# EAGLE design x-OSC Gloves_v2 (EAGLE 6.4)
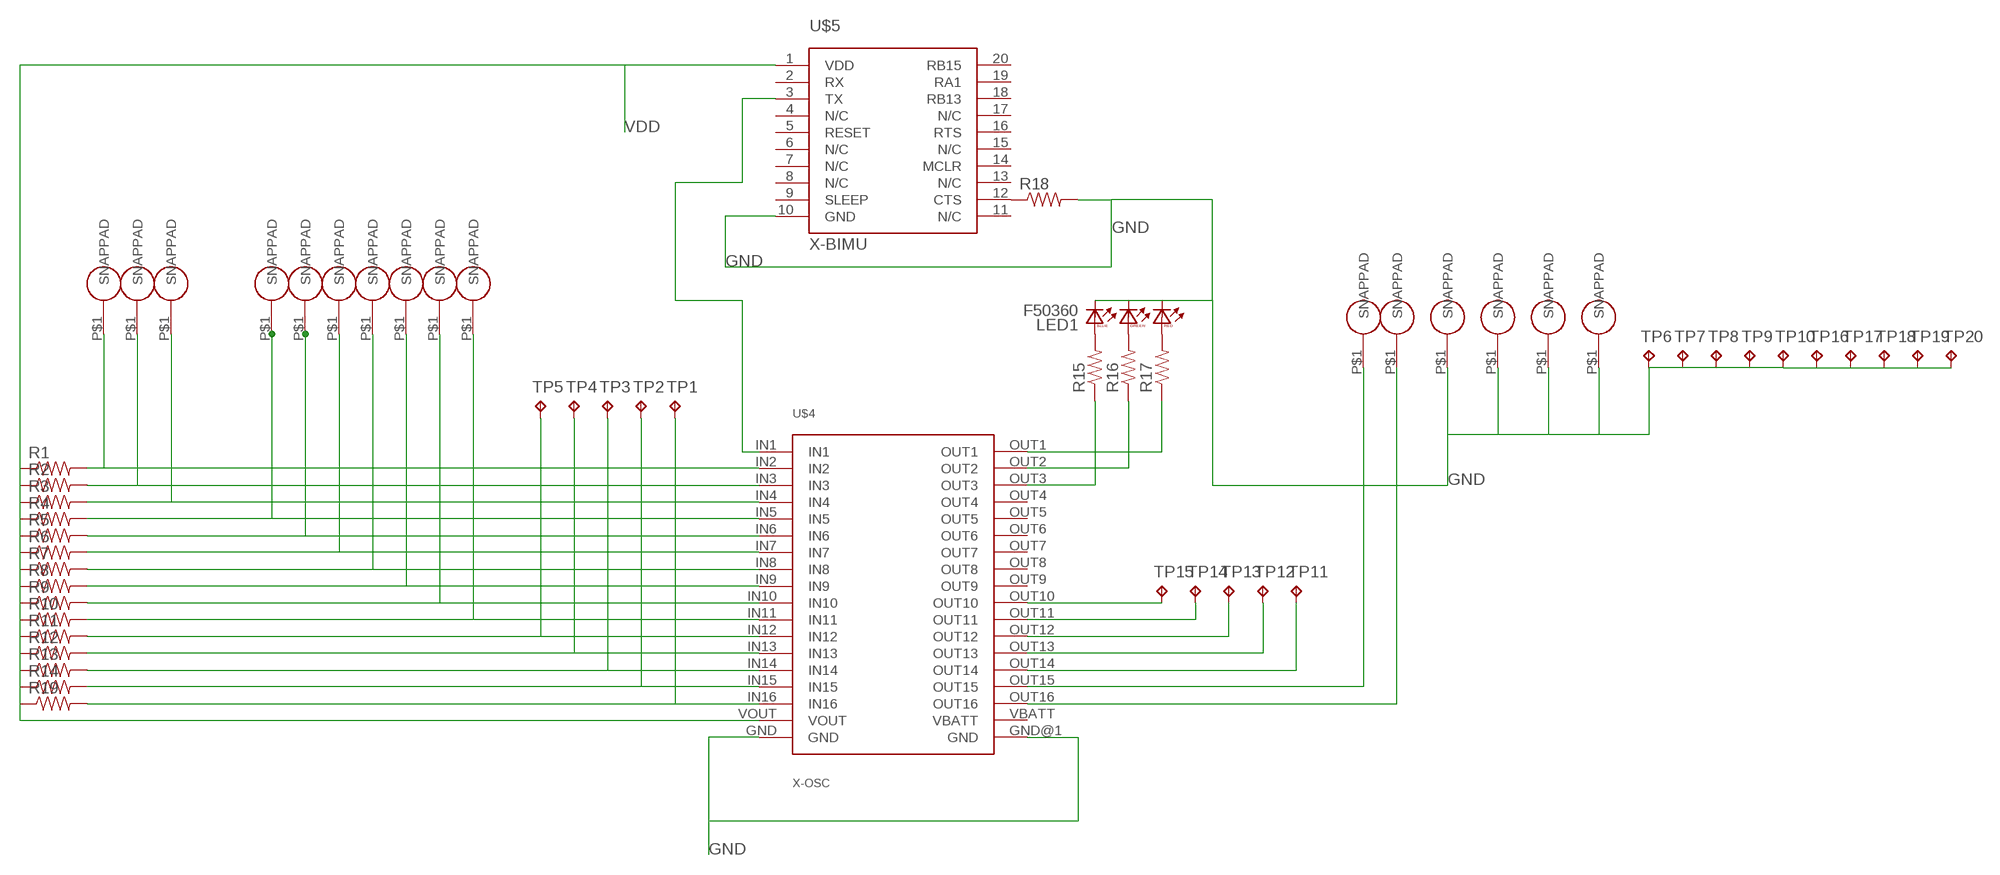
[diagram p0: schematic, sheet 1]

## Parts
LED1  F50360  [F50360]
R1  RESISTOR0805-RES  [0805]
R2  RESISTOR0805-RES  [0805]
R3  RESISTOR0805-RES  [0805]
R4  RESISTOR0805-RES  [0805]
R5  RESISTOR0805-RES  [0805]
R6  RESISTOR0805-RES  [0805]
R7  RESISTOR0805-RES  [0805]
R8  RESISTOR0805-RES  [0805]
R9  RESISTOR0805-RES  [0805]
R10  RESISTOR0805-RES  [0805]
R11  RESISTOR0805-RES  [0805]
R12  RESISTOR0805-RES  [0805]
R13  RESISTOR0805-RES  [0805]
R14  RESISTOR0805-RES  [0805]
R15  RESISTOR0805-RES  [0805]
R16  RESISTOR0805-RES  [0805]
R17  RESISTOR0805-RES  [0805]
R18  RESISTOR0805-RES  [0805]
R19  RESISTOR0805-RES  [0805]
TP1  TPTP20R  [TP20R]
TP2  TPTP20R  [TP20R]
TP3  TPTP20R  [TP20R]
TP4  TPTP20R  [TP20R]
TP5  TPTP20R  [TP20R]
TP6  TPTP20R  [TP20R]
TP7  TPTP20R  [TP20R]
TP8  TPTP20R  [TP20R]
TP9  TPTP20R  [TP20R]
TP10  TPTP20R  [TP20R]
TP11  TPTP20R  [TP20R]
TP12  TPTP20R  [TP20R]
TP13  TPTP20R  [TP20R]
TP14  TPTP20R  [TP20R]
TP15  TPTP20R  [TP20R]
TP16  TPTP20R  [TP20R]
TP17  TPTP20R  [TP20R]
TP18  TPTP20R  [TP20R]
TP19  TPTP20R  [TP20R]
TP20  TPTP20R  [TP20R]
U$1  SNAP-PAD_7MM_ROUND  [SNAP-PAD_7MM_RD]
U$2  SNAP-PAD_7MM_ROUND  [SNAP-PAD_7MM_RD]
U$3  SNAP-PAD_7MM_ROUND  [SNAP-PAD_7MM_RD]
U$4  X-OSC  [X-OSC_SMD]
U$5  X-BIMU  [X-BIMU_SMD]
U$6  SNAP-PAD_7MM_ROUND  [SNAP-PAD_7MM_RD]
U$7  SNAP-PAD_7MM_ROUND  [SNAP-PAD_7MM_RD]
U$8  SNAP-PAD_7MM_ROUND  [SNAP-PAD_7MM_RD]
U$9  SNAP-PAD_7MM_ROUND  [SNAP-PAD_7MM_RD]
U$10  SNAP-PAD_7MM_ROUND  [SNAP-PAD_7MM_RD]
U$11  SNAP-PAD_7MM_ROUND  [SNAP-PAD_7MM_RD]
U$12  SNAP-PAD_7MM_ROUND  [SNAP-PAD_7MM_RD]
U$13  SNAP-PAD_7MM_ROUND  [SNAP-PAD_7MM_RD]
U$14  SNAP-PAD_7MM_ROUND  [SNAP-PAD_7MM_RD]
U$15  SNAP-PAD_7MM_ROUND  [SNAP-PAD_7MM_RD]
U$16  SNAP-PAD_7MM_ROUND  [SNAP-PAD_7MM_RD]
U$17  SNAP-PAD_7MM_ROUND  [SNAP-PAD_7MM_RD]
U$18  SNAP-PAD_7MM_ROUND  [SNAP-PAD_7MM_RD]

## Nets
GND: LED1.BC LED1.GC LED1.RC R18.2 TP6.TP TP7.TP TP8.TP TP9.TP TP10.TP TP16.TP TP17.TP TP18.TP TP19.TP TP20.TP U$4.GND U$4.GND@1(GND) U$5.10(GND) U$15.P$1(SNAPPAD) U$16.P$1(SNAPPAD) U$17.P$1(SNAPPAD) U$18.P$1(SNAPPAD)
N$1: LED1.BA R15.2
N$2: LED1.GA R16.2
N$3: R15.1 U$4.OUT3
N$4: R1.2 U$1.P$1(SNAPPAD) U$4.IN2
N$5: R16.1 U$4.OUT2
N$6: R2.2 U$2.P$1(SNAPPAD) U$4.IN3
N$7: R3.2 U$3.P$1(SNAPPAD) U$4.IN4
N$8: R4.2 U$4.IN5 U$6.P$1(SNAPPAD)
N$9: R5.2 U$4.IN6 U$7.P$1(SNAPPAD)
N$10: R18.1 U$5.12(CTS)
N$11: U$4.IN1 U$5.3(TX)
N$12: R6.2 U$4.IN7 U$8.P$1(SNAPPAD)
N$13: R7.2 U$4.IN8 U$9.P$1(SNAPPAD)
N$14: R8.2 U$4.IN9 U$10.P$1(SNAPPAD)
N$15: R9.2 U$4.IN10 U$11.P$1(SNAPPAD)
N$16: R10.2 U$4.IN11 U$12.P$1(SNAPPAD)
N$17: LED1.RA R17.2
N$18: R11.2 TP5.TP U$4.IN12
N$19: R12.2 TP4.TP U$4.IN13
N$20: R13.2 TP3.TP U$4.IN14
N$21: R14.2 TP2.TP U$4.IN15
N$22: R19.2 TP1.TP U$4.IN16
N$23: U$4.OUT15 U$13.P$1(SNAPPAD)
N$24: U$4.OUT16 U$14.P$1(SNAPPAD)
N$25: R17.1 U$4.OUT1
N$26: TP11.TP U$4.OUT14
N$29: TP12.TP U$4.OUT13
N$30: TP13.TP U$4.OUT12
N$31: TP14.TP U$4.OUT11
N$32: TP15.TP U$4.OUT10
VDD: R1.1 R2.1 R3.1 R4.1 R5.1 R6.1 R7.1 R8.1 R9.1 R10.1 R11.1 R12.1 R13.1 R14.1 R19.1 U$4.VOUT U$5.1(VDD)
Unconnected: U$4.OUT4 U$4.OUT5 U$4.OUT6 U$4.OUT7 U$4.OUT8 U$4.OUT9 U$4.VBATT U$5.2(RX) U$5.4(N/C) U$5.5(RESET) U$5.6(N/C) U$5.7(N/C) U$5.8(N/C) U$5.9(SLEEP) U$5.11(N/C) U$5.13(N/C) U$5.14(MCLR) U$5.15(N/C) U$5.16(RTS) U$5.17(N/C) U$5.18(RB13) U$5.19(RA1) U$5.20(RB15)

## Library data of the parts
LED1 = led:F50360: Full color Z-Power LED RGB P5-II Series Source: http://www.seoulsemicon.co.kr .. F50360.pdf
R1-R19 = SparkFun-Passives:RESISTOR: Resistor Basic schematic elements and footprints for 0603, 1206, and PTH resistors.
TP1-TP20 = testpad:TP: Test pad
U$1-U$3 U$6-U$18 = hannahsEagleLib:SNAP-PAD_7MM_ROUND
U$4 = x-io:X-OSC: 2x "TSM-118-04-F-SV" See: http://www.toby.co.uk/content/catalogue/products.aspx?series=TSM-1xx-xx-SV
U$5 = x-io:X-BIMU

## Board
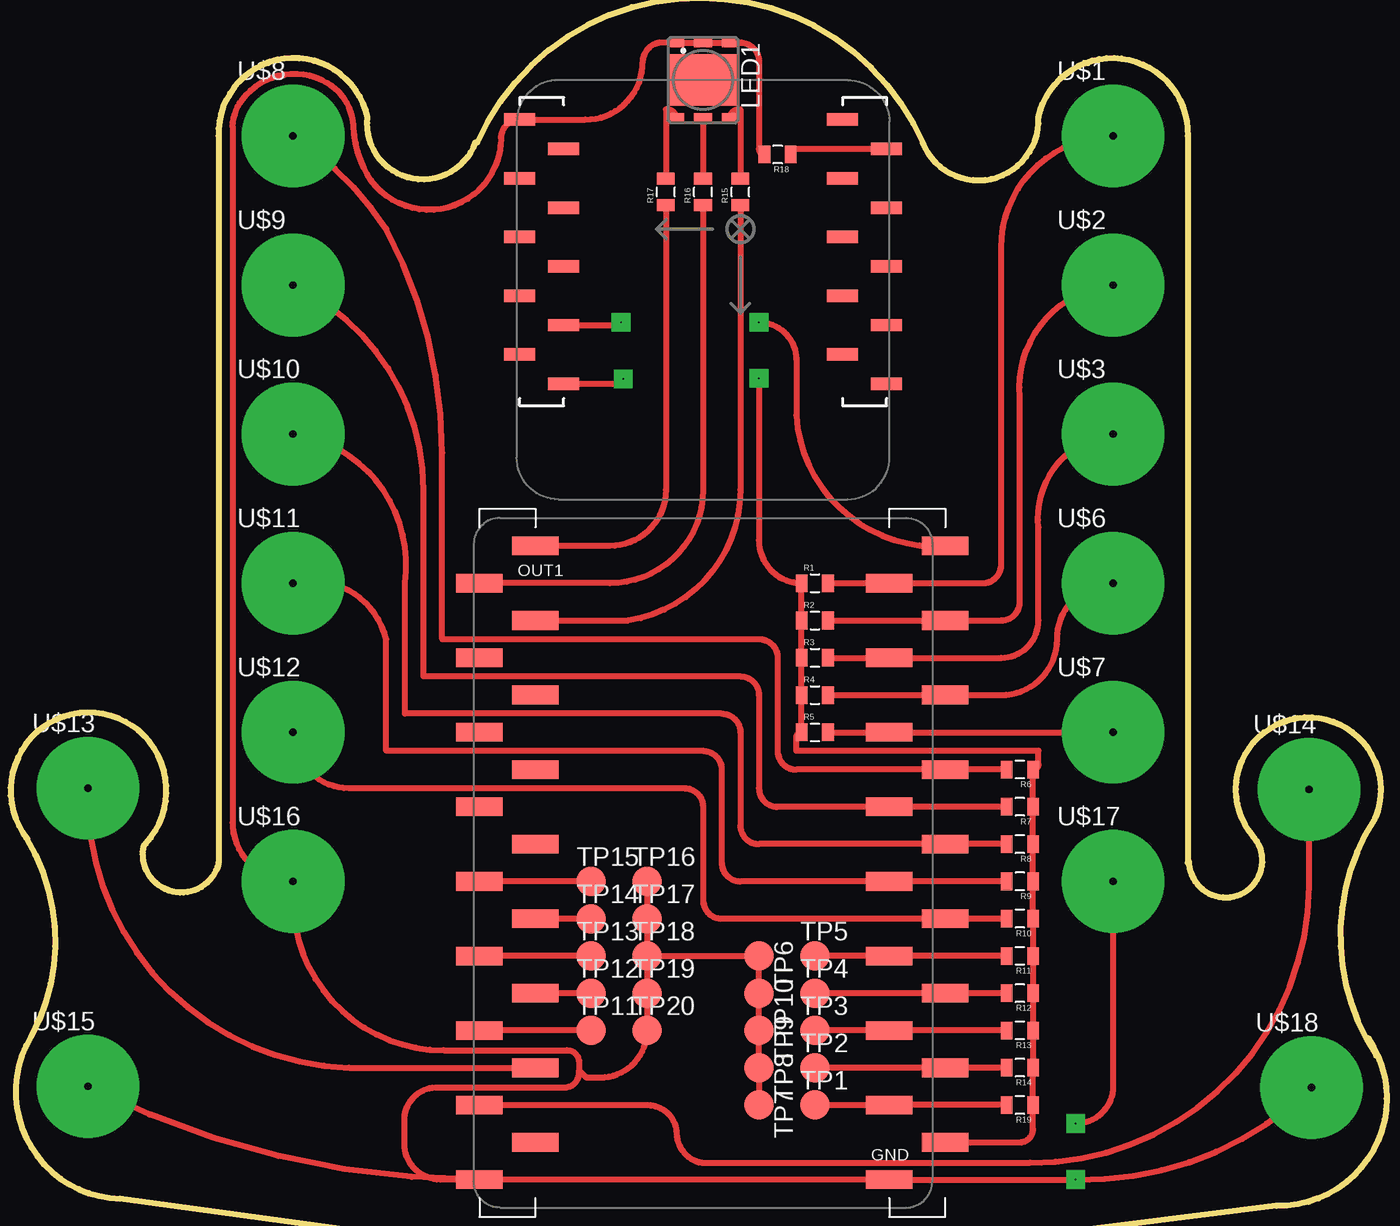
[diagram p1: board, top side]
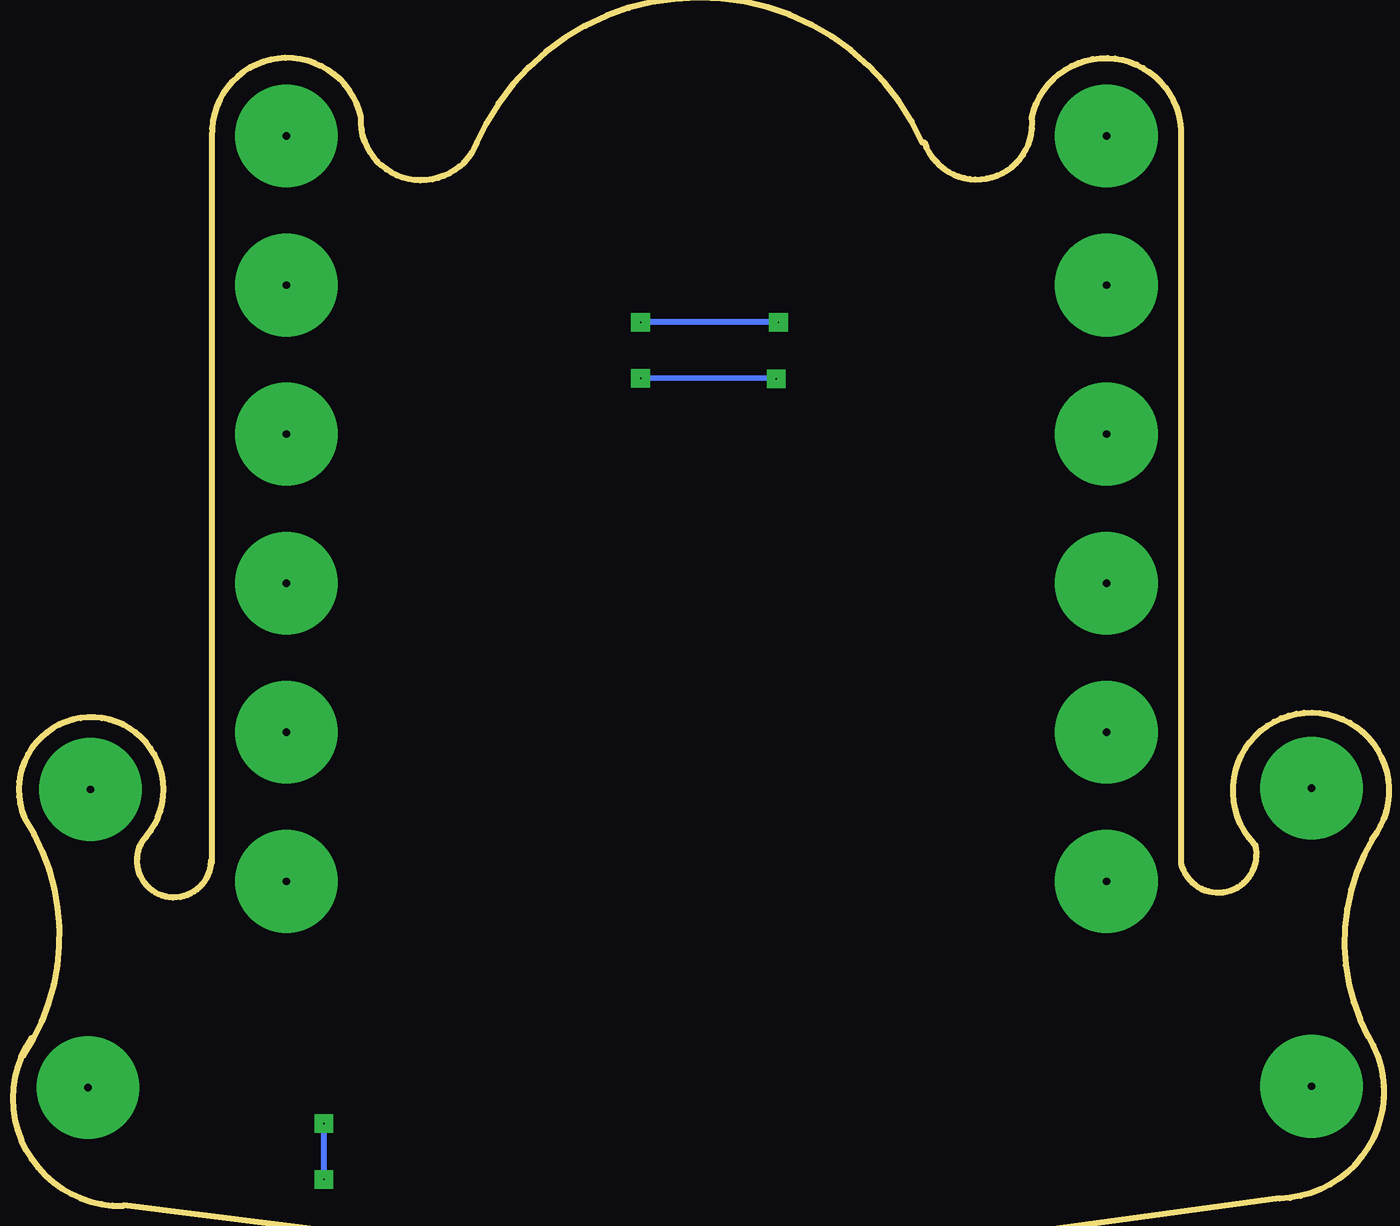
[diagram p2: board, bottom side, seen from below]

No outline drawn. Coordinates in mm, seen from the top.
Copper layers (1*16): Top 0.035mm / dielectric 1.5mm / Bottom 0.035mm
Design rules "default": minimum track width 10mil, minimum drill 24mil, track to track 8mil, track to pad 8mil, pad to pad 8mil, via to via 8mil, smd to smd 8mil, copper to edge 40mil, drill to drill 8mil, minimum pad ring 10mil, minimum via ring 8mil, stop-mask expansion 4mil, vias tented up to drill 0mil, thermal gap 10mil
Milling: 16 lines

### Footprints (pad centres in the part's own frame; a part is rotated, then mirrored left to right if it is on the bottom)
F50360 = smd 0.6 x 1.05: BA 2.55,1.825; BC -2.55,1.825; RA 2.55,-1.825; RC -2.55,-1.825 | smd 0.6 x 1.2: GA 2.55,0; GC -2.55,0 | smd 3.5 x 4.7: NC 0,0
0805 = smd 0.8 x 1.2: 1 -0.9,0; 2 0.9,0
TP20R = smd 2 x 2: TP 0,0
SNAP-PAD_7MM_RD = drill 0.5 pad 7: P$1 0,0
X-OSC_SMD = smd 3.17 x 1.27: GND 12.7,-21.59; GND@1 -15.24,-21.59; IN1 16.51,21.59; IN2 12.7,19.05; IN3 16.51,16.51; IN4 12.7,13.97; IN5 16.51,11.43; IN6 12.7,8.89; IN7 16.51,6.35; IN8 12.7,3.81; IN9 16.51,1.27; IN10 12.7,-1.27; IN11 16.51,-3.81; IN12 12.7,-6.35; IN13 16.51,-8.89; IN14 12.7,-11.43; IN15 16.51,-13.97; IN16 12.7,-16.51; OUT1 -11.43,21.59; OUT2 -15.24,19.05; OUT3 -11.43,16.51; OUT4 -15.24,13.97; OUT5 -11.43,11.43; OUT6 -15.24,8.89; OUT7 -11.43,6.35; OUT8 -15.24,3.81; OUT9 -11.43,1.27; OUT10 -15.24,-1.27; OUT11 -11.43,-3.81; OUT12 -15.24,-6.35; OUT13 -11.43,-8.89; OUT14 -15.24,-11.43; OUT15 -11.43,-13.97; OUT16 -15.24,-16.51; VBATT -11.43,-19.05; VOUT 16.51,-19.05
X-BIMU_SMD = smd 2.1 x 0.85: 1 9.5,8; 2 12.5,6; 3 9.5,4; 4 12.5,2; 5 9.5,0; 6 12.5,-2; 7 9.5,-4; 8 12.5,-6; 9 9.5,-8; 10 12.5,-10; 11 -9.5,-10; 12 -12.5,-8; 13 -9.5,-6; 14 -12.5,-4; 15 -9.5,-2; 16 -12.5,0; 17 -9.5,2; 18 -12.5,4; 19 -9.5,6; 20 -12.5,8

### Placement (x,y rotation side)
LED1  48.26,77.47 270 top
R1  55.88,43.18 0 top
R2  55.88,40.64 0 top
R3  55.88,38.1 0 top
R4  55.88,35.56 0 top
R5  55.88,33.02 0 top
R6  69.85,30.48 180 top
R7  69.85,27.94 180 top
R8  69.85,25.4 180 top
R9  69.85,22.86 180 top
R10  69.85,20.32 180 top
R11  69.85,17.78 180 top
R12  69.85,15.24 180 top
R13  69.85,12.7 180 top
R14  69.85,10.16 180 top
R15  50.8,69.85 90 top
R16  48.26,69.85 90 top
R17  45.72,69.85 90 top
R18  53.34,72.39 180 top
R19  69.85,7.62 180 top
TP1  55.88,7.62 0 top
TP2  55.88,10.16 0 top
TP3  55.88,12.7 0 top
TP4  55.88,15.24 0 top
TP5  55.88,17.78 0 top
TP6  52.07,17.78 270 top
TP7  52.07,7.62 270 top
TP8  52.07,10.16 270 top
TP9  52.07,12.7 270 top
TP10  52.07,15.24 270 top
TP11  40.64,12.7 0 top
TP12  40.64,15.24 0 top
TP13  40.64,17.78 0 top
TP14  40.64,20.32 0 top
TP15  40.64,22.86 0 top
TP16  44.45,22.86 0 top
TP17  44.45,20.32 0 top
TP18  44.45,17.78 0 top
TP19  44.45,15.24 0 top
TP20  44.45,12.7 0 top
U$1  76.2,73.66 0 top
U$2  76.2,63.5 0 top
U$3  76.2,53.34 0 top
U$4  48.26,24.13 0 top
U$5  48.26,64.77 180 top
U$6  76.2,43.18 0 top
U$7  76.2,33.02 0 top
U$8  20.32,73.66 0 top
U$9  20.32,63.5 0 top
U$10  20.32,53.34 0 top
U$11  20.32,43.18 0 top
U$12  20.32,33.02 0 top
U$13  6.35,29.21 0 top
U$14  89.56,29.13 0 top
U$15  6.35,8.89 0 top
U$16  20.32,22.86 0 top
U$17  76.2,22.86 0 top
U$18  89.72,8.81 0 top

### Tracks (layer width: path | path; a pad name or v marks a point on that pad's centre or on a via)
GND  (via drill 0.1 pad 1.27)  (1 unrouted)
  Top 0.406: TP7.TP TP8.TP TP9.TP TP10.TP TP6.TP TP18.TP | U$4.GND@1 U$4.GND 73.66,2.54 arc45 U$18.P$1 | TP18.TP TP17.TP TP16.TP TP18.TP | TP18.TP TP19.TP TP20.TP arc-90 41.25,9.5 40.29,9.5 39.81,9.98 | R18.2 arc-90 52.07,72.76 52.07,78.74 arc90 50.79,80.02 LED1.BC LED1.GC LED1.RC 45.48,80.02 arc90 44.14,78.68 arc-90 40.23,74.77 U$5.10 35.75,74.77 arc90 34.49,73.51 arc-155 25.15,71.48 arc-21 24.44,74.36 arc57 22.65,77.27 arc83 16.84,76.13 arc35 16.18,74.32 16.19,74.32 16.19,26.87 arc90 U$16.P$1 20.32,21.61 arc90 30.58,11.35 38.99,11.35 arc-95 39.81,10.46 39.81,9.98 | U$17.P$1 76.2,8.89 arc-90 v73.66,6.35 | U$4.GND@1 arc-27 U$15.P$1 | U$4.GND@1 30.36,2.54 arc-90 27.91,4.99 27.91,6.7 arc-90 30.23,8.83 38.92,8.83 arc90 39.81,9.91 39.81,9.98
  Bottom 0.406: v73.66,6.35 73.66,2.54
N$1
  Top 0.406: LED1.BA arc-90 50.8,75.47 R15.2
N$2
  Top 0.406: LED1.GA R16.2
N$3
  Top 0.406: R15.1 50.8,49.53 arc-81 43.18,40.64 U$4.OUT3
N$4
  Top 0.406: 67.31,43.18 arc90 68.58,44.45 | U$1.P$1 arc90 68.58,66.04 68.58,44.45 | R1.2 U$4.IN2 67.31,43.18 | 67.31,43.18 arc90 68.58,44.45
N$5
  Top 0.406: R16.1 48.26,49.53 arc-90 41.91,43.18 U$4.OUT2
N$6
  Top 0.406: R2.2 U$4.IN3 68.58,40.64 arc90 69.85,41.91 69.85,55.88 arc-90 U$2.P$1
N$7
  Top 0.406: R3.2 U$4.IN4 68.58,38.1 arc90 71.12,40.64 71.12,46.99 arc-90 U$3.P$1
N$8
  Top 0.406: R4.2 U$4.IN5 68.58,35.56 arc90 72.39,39.37 arc-90 U$6.P$1
N$9
  Top 0.406: R5.2 U$4.IN6 U$7.P$1
N$10
  Top 0.406: U$5.12 54.62,72.77 arc90 R18.1
N$11  (via drill 0.1 pad 1.27)
  Top 0.406: U$5.3 42.67,60.77 v42.67,60.96 | v52.07,60.96 arc-90 54.61,58.42 54.61,54.61 arc90 U$4.IN1
  Bottom 0.406: v42.67,60.96 v52.07,60.96
N$12
  Top 0.406: R6.2 U$4.IN7 54.61,30.48 arc-90 53.34,31.75 53.34,38.1 arc90 52.07,39.37 30.48,39.37 30.48,52.07 arc28 26.67,67.31 arc23 U$8.P$1
N$13
  Top 0.406: R7.2 U$4.IN8 53.34,27.94 arc-90 52.07,29.21 52.07,35.56 arc90 50.8,36.83 29.21,36.83 29.21,49.53 arc65 U$9.P$1
N$14
  Top 0.406: R8.2 U$4.IN9 52.07,25.4 arc-90 50.8,26.67 50.8,33.02 arc90 49.53,34.29 27.94,34.29 27.94,43.18 arc90 U$10.P$1
N$15
  Top 0.406: R9.2 U$4.IN10 50.8,22.86 arc-90 49.53,24.13 49.53,30.48 arc90 48.26,31.75 26.67,31.75 26.67,39.37 arc90 U$11.P$1
N$16
  Top 0.406: R10.2 U$4.IN11 49.53,20.32 arc-90 48.26,21.59 48.26,27.94 arc90 46.99,29.21 24.13,29.21 arc-90 U$12.P$1
N$17
  Top 0.406: LED1.RA arc90 45.72,75.47 R17.2
N$18
  Top 0.406: R11.2 U$4.IN12 TP5.TP
N$19
  Top 0.406: R12.2 U$4.IN13 TP4.TP
N$20
  Top 0.406: R13.2 U$4.IN14 TP3.TP
N$21
  Top 0.406: R14.2 U$4.IN15 TP2.TP
N$22
  Top 0.406: R19.2 U$4.IN16 TP1.TP
N$23
  Top 0.406: U$13.P$1 arc90 24.13,10.16 U$4.OUT15
N$24
  Top 0.406: U$4.OUT16 44.48,7.62 arc-90 46.45,5.64 arc77 48.18,3.69 70.53,3.69 arc90 89.56,22.5 U$14.P$1
N$25
  Top 0.406: R17.1 45.72,49.53 arc-90 41.91,45.72 U$4.OUT1
N$26
  Top 0.406: TP11.TP U$4.OUT14
N$29
  Top 0.406: TP12.TP U$4.OUT13
N$30
  Top 0.406: TP13.TP U$4.OUT12
N$31
  Top 0.406: TP14.TP U$4.OUT11
N$32
  Top 0.406: TP15.TP U$4.OUT10
N$33  (via drill 0.1 pad 1.27)
  other vias: 73.66,2.54
N$38  (via drill 0.1 pad 1.27)
  other vias: 73.66,6.35
VDD  (via drill 0.1 pad 1.27)
  Top 0.406: U$4.VOUT 69.85,5.08 arc90 70.75,5.98 R19.1 R14.1 R13.1 R12.1 R11.1 R10.1 R9.1 R8.1 R7.1 R6.1 arc90 71.12,30.85 71.12,31.75 54.61,31.75 54.61,32.65 arc-90 R5.1 R4.1 R3.1 R2.1 R1.1 arc-90 52.07,46.09 v52.07,57.15 | U$5.1 42.49,56.77 arc90 v42.83,57.11
  Bottom 0.406: v42.83,57.11 v52.07,57.15